# EAGLE schematic waterlevel (EAGLE 6.2)
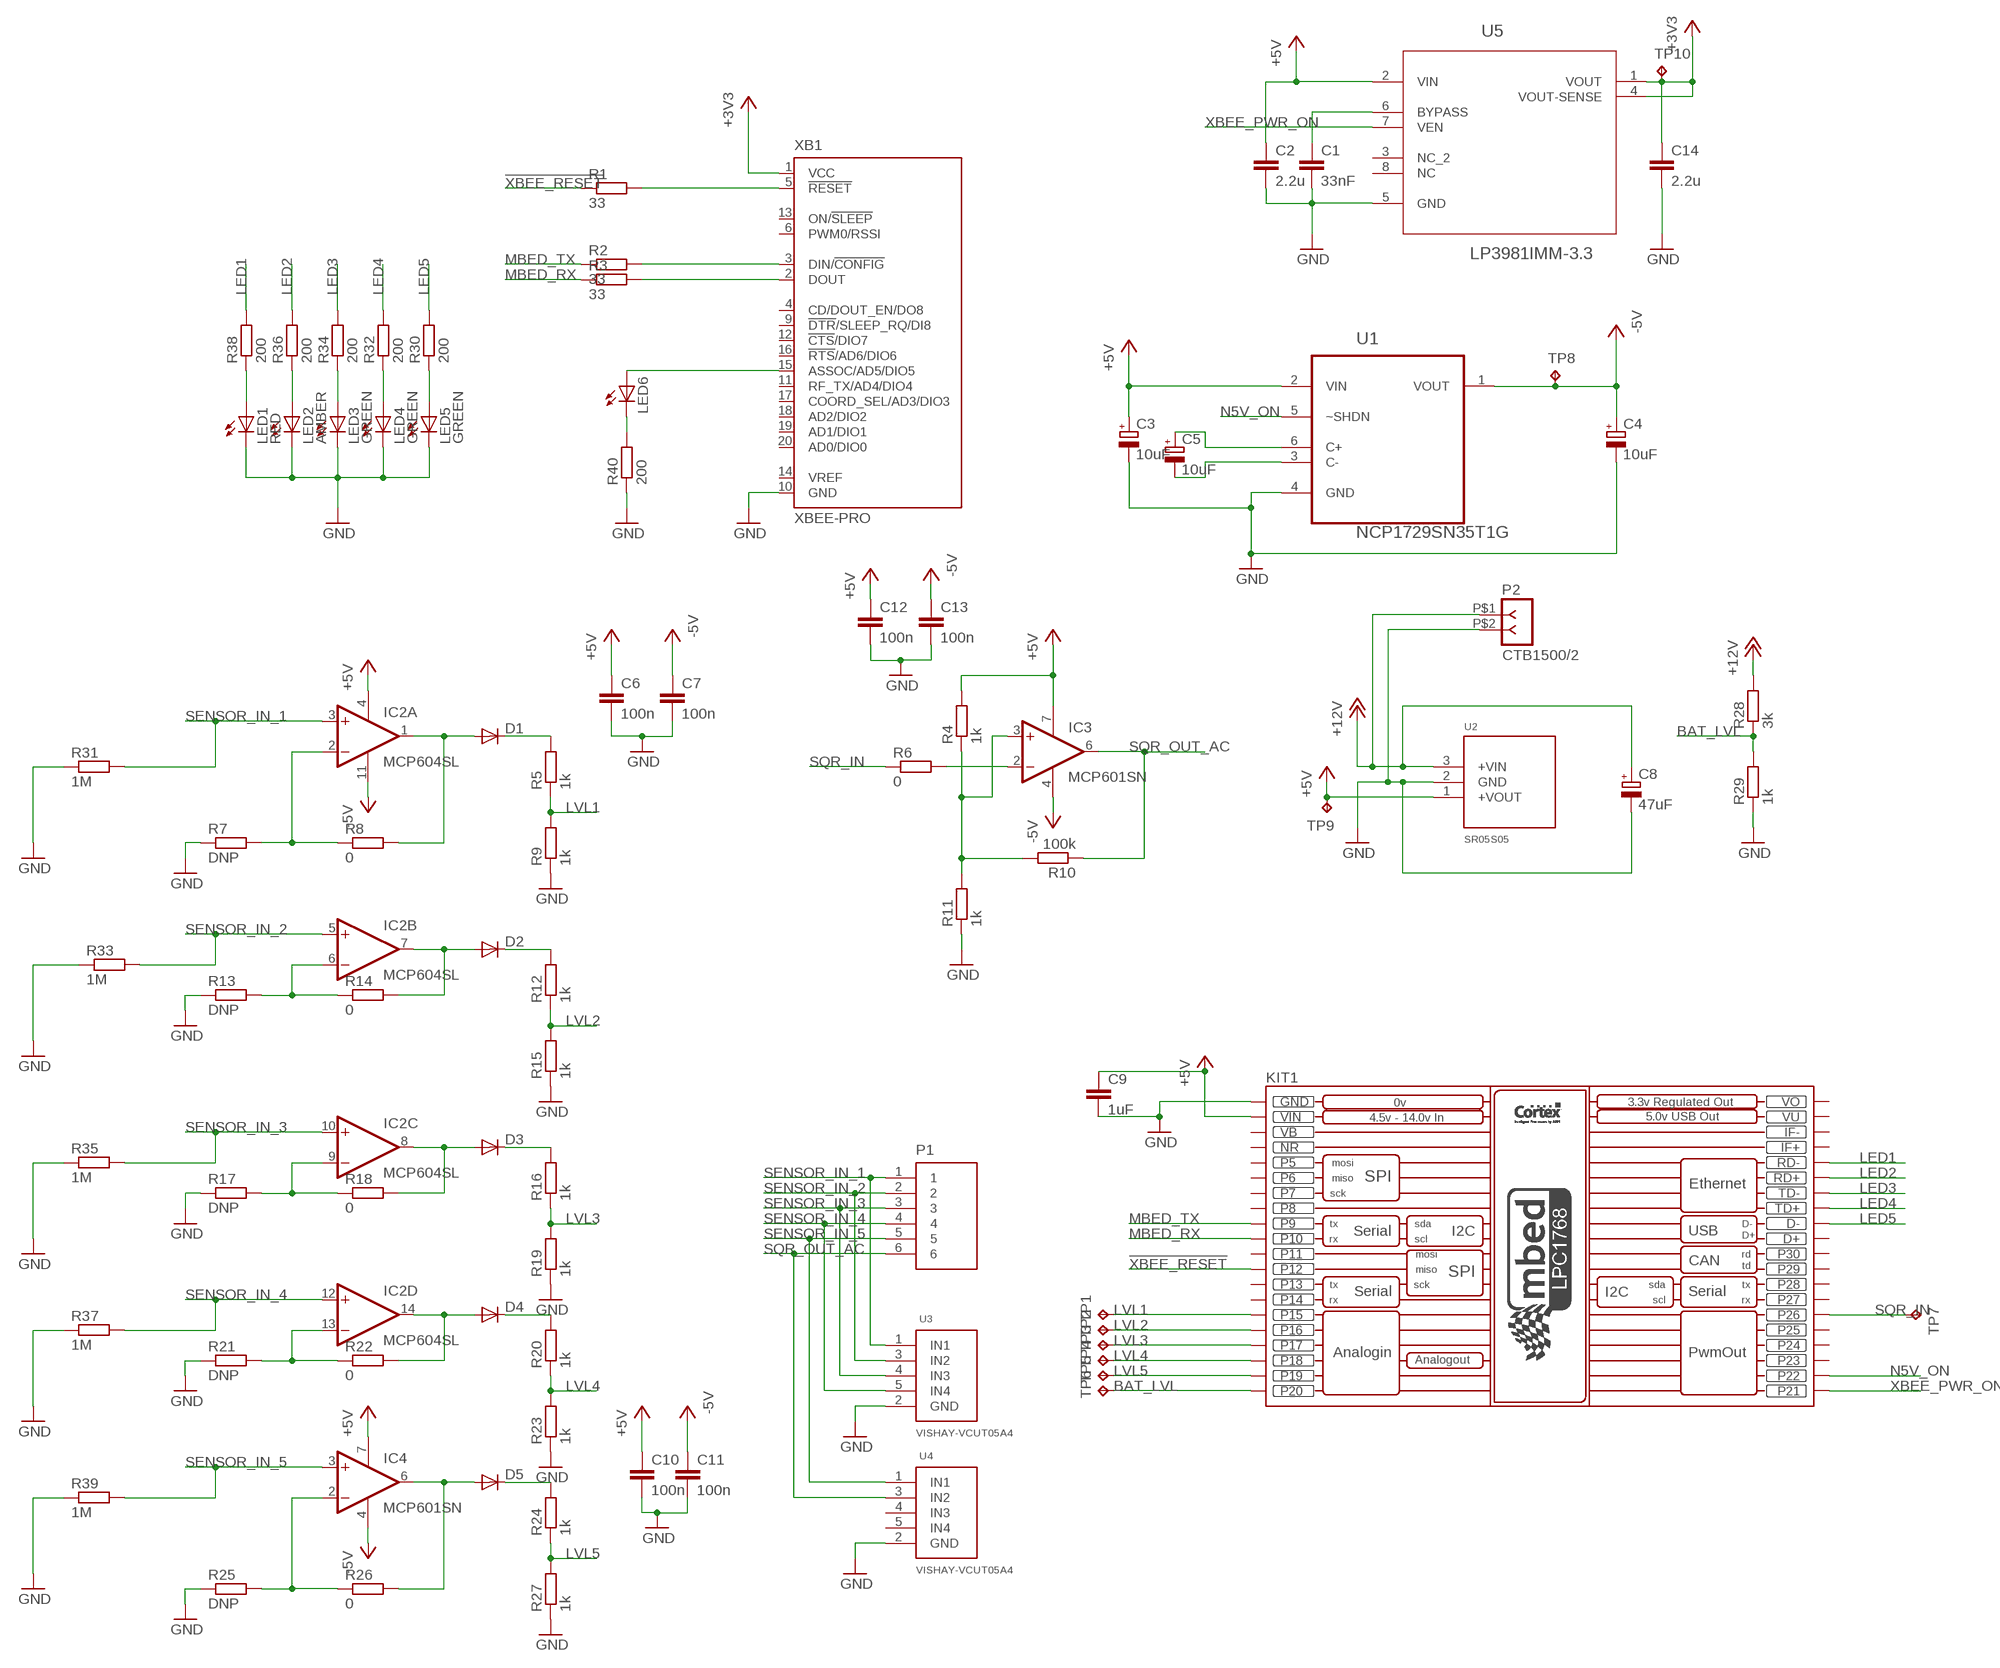
[diagram p0: schematic, sheet 1]

## Parts
C1  33nF  C-EUC0603  [C0603]
C2  2.2u  C-EUC0603  [C0603]
C3  10uF  CPOL-EUD/7343-31R  [D/7343-31R]
C4  10uF  CPOL-EUD/7343-31R  [D/7343-31R]
C5  10uF  CPOL-EUD/7343-31R  [D/7343-31R]
C6  100n  C-EUC1206  [C1206]
C7  100n  C-EUC1206  [C1206]
C8  47uF  CPOL-EUD/7343-31R  [D/7343-31R]
C9  1uF  C-EUC1206  [C1206]
C10  100n  C-EUC1206  [C1206]
C11  100n  C-EUC1206  [C1206]
C12  100n  C-EUC1206  [C1206]
C13  100n  C-EUC1206  [C1206]
C14  2.2u  C-EUC0603  [C0603]
D1  DIODE-SOD323-R  [SOD323-R]
D2  DIODE-SOD323-R  [SOD323-R]
D3  DIODE-SOD323-R  [SOD323-R]
D4  DIODE-SOD323-R  [SOD323-R]
D5  DIODE-SOD323-R  [SOD323-R]
IC2  MCP604SL  [SO14]
IC3  MCP601SN  [SO08]
IC4  MCP601SN  [SO08]
KIT1  MBED_NXP_LPC1768  [MBED-KIT]
LED1  RED  LEDCHIPLED_0805  [CHIPLED_0805]
LED2  AMBER  LEDCHIPLED_0805  [CHIPLED_0805]
LED3  GREEN  LEDCHIPLED_0805  [CHIPLED_0805]
LED4  GREEN  LEDCHIPLED_0805  [CHIPLED_0805]
LED5  GREEN  LEDCHIPLED_0805  [CHIPLED_0805]
LED6  LEDCHIPLED_0805  [CHIPLED_0805]
P1  CAMDEN-CTB5000/6  [CAMDEN-CTB5000]
P2  CTB1500/2  [CTB1500-2]
R1  33  R-EU_R0603  [R0603]
R2  33  R-EU_R0603  [R0603]
R3  33  R-EU_R0603  [R0603]
R4  1k  R-EU_R0805  [R0805]
R5  1k  R-EU_R0805  [R0805]
R6  0  R-EU_R0603  [R0603]
R7  DNP  R-EU_R0603  [R0603]
R8  0  R-EU_R0603  [R0603]
R9  1k  R-EU_R0805  [R0805]
R10  100k  R-EU_R0805  [R0805]
R11  1k  R-EU_R0805  [R0805]
R12  1k  R-EU_R0805  [R0805]
R13  DNP  R-EU_R0603  [R0603]
R14  0  R-EU_R0603  [R0603]
R15  1k  R-EU_R0805  [R0805]
R16  1k  R-EU_R0805  [R0805]
R17  DNP  R-EU_R0603  [R0603]
R18  0  R-EU_R0603  [R0603]
R19  1k  R-EU_R0805  [R0805]
R20  1k  R-EU_R0805  [R0805]
R21  DNP  R-EU_R0603  [R0603]
R22  0  R-EU_R0603  [R0603]
R23  1k  R-EU_R0805  [R0805]
R24  1k  R-EU_R0805  [R0805]
R25  DNP  R-EU_R0603  [R0603]
R26  0  R-EU_R0603  [R0603]
R27  1k  R-EU_R0805  [R0805]
R28  3k  R-EU_R0805  [R0805]
R29  1k  R-EU_R0805  [R0805]
R30  200  R-EU_R0603  [R0603]
R31  1M  R-EU_R0805  [R0805]
R32  200  R-EU_R0603  [R0603]
R33  1M  R-EU_R0805  [R0805]
R34  200  R-EU_R0603  [R0603]
R35  1M  R-EU_R0805  [R0805]
R36  200  R-EU_R0603  [R0603]
R37  1M  R-EU_R0805  [R0805]
R38  200  R-EU_R0603  [R0603]
R39  1M  R-EU_R0805  [R0805]
R40  200  R-EU_R0603  [R0603]
TP1  TPTP13R  [TP13R]
TP2  TPTP13R  [TP13R]
TP3  TPTP13R  [TP13R]
TP4  TPTP13R  [TP13R]
TP5  TPTP13R  [TP13R]
TP6  TPTP13R  [TP13R]
TP7  TPTP13R  [TP13R]
TP8  TPTP13R  [TP13R]
TP9  TPTP13R  [TP13R]
TP10  TPTP13R  [TP13R]
U1  NCP1729SN35T1G  [SOP95P275X110-6N]
U2  SR05S05  [XP-SR-SERIES]
U3  VISHAY-VCUT05A4  [SOT23-5]
U4  VISHAY-VCUT05A4  [SOT23-5]
U5  LP3981IMM-3.3  [SOP65P490X110-8N]
XB1  XBEE-PRO  [XBEE-PRO]

## Nets
!XBEE_RESET!: KIT1.P$12(P12) R1.1
+3V3: C14.1 TP10.TP U5.1(VOUT) U5.4(VOUT-SENSE) XB1.1(VCC)
+5V: C2.1 C3.+ C6.1 C9.1 C10.1 C12.1 IC2.4(P:V+) IC3.7(V+) IC4.7(V+) KIT1.VIN R4.2 TP9.TP U1.2(VIN) U2.1(+VOUT) U5.2(VIN)
+12V: C8.+ P2.P$1 R28.2 U2.3(+VIN)
-5V: C4.+ C7.1 C11.1 C13.1 IC2.11(P:V-) IC3.4(V-) IC4.4(V-) TP8.TP U1.1(VOUT)
BAT_LVL: KIT1.P$20(P20) R28.1 R29.2 TP6.TP
GND: C1.2 C2.2 C3.- C4.- C6.2 C7.2 C8.- C9.2 C10.2 C11.2 C12.2 C13.2 C14.2 KIT1.GND LED1.C LED2.C LED3.C LED4.C LED5.C P2.P$2 R7.1 R9.1 R11.1 R13.1 R15.1 R17.1 R19.1 R21.1 R23.1 R25.1 R27.1 R29.1 R31.1 R33.1 R35.1 R37.1 R39.1 R40.1 U1.4(GND) U2.2(GND) U3.2(GND) U4.2(GND) U5.5(GND) XB1.10(GND)
LED1: KIT1.RD- R38.2
LED2: KIT1.RD+ R36.2
LED3: KIT1.TD- R34.2
LED4: KIT1.TD+ R32.2
LED5: KIT1.D- R30.2
LVL1: KIT1.P$15(P15) R5.1 R9.2 TP1.TP
LVL2: KIT1.P$16(P16) R12.1 R15.2 TP2.TP
LVL3: KIT1.P$17(P17) R16.1 R19.2 TP3.TP
LVL4: KIT1.P$18(P18) R20.1 R23.2 TP4.TP
LVL5: KIT1.P$19(P19) R24.1 R27.2 TP5.TP
MBED_RX: KIT1.P$10(P10) R3.1
MBED_TX: KIT1.P$9(P9) R2.1
N5V_ON: KIT1.P$22(P22) U1.5(~SHDN)
N$1: IC3.2(-IN) R6.2
N$2: D2.A IC2.7(B:OUT) R14.2
N$3: D3.A IC2.8(C:OUT) R18.2
N$4: D4.A IC2.14(D:OUT) R22.2
N$5: D5.A IC4.6(OUT) R26.2
N$6: IC4.2(-IN) R25.2 R26.1
N$7: IC2.13(D:-IN) R21.2 R22.1
N$8: IC2.9(C:-IN) R17.2 R18.1
N$9: IC2.6(B:-IN) R13.2 R14.1
N$10: IC2.2(A:-IN) R7.2 R8.1
N$11: C5.+ U1.6(C+)
N$12: D2.C R12.2
N$13: C5.- U1.3(C-)
N$14: D1.C R5.2
N$15: D1.A IC2.1(A:OUT) R8.2
N$16: D3.C R16.2
N$17: LED6.A XB1.15(ASSOC/AD5/DIO5)
N$18: D4.C R20.2
N$19: R1.2 XB1.5(!RESET)
N$20: D5.C R24.2
N$21: R2.2 XB1.3(DIN/!CONFIG)
N$22: R3.2 XB1.2(DOUT)
N$23: IC3.3(+IN) R4.1 R10.2 R11.2
N$24: LED6.C R40.2
N$25: LED5.A R30.1
N$26: LED4.A R32.1
N$27: LED3.A R34.1
N$28: C1.1 U5.6(BYPASS)
N$29: LED2.A R36.1
N$30: LED1.A R38.1
SENSOR_IN_1: IC2.3(A:+IN) P1.1 R31.2 U3.1(IN1)
SENSOR_IN_2: IC2.5(B:+IN) P1.2 R33.2 U3.3(IN2)
SENSOR_IN_3: IC2.10(C:+IN) P1.3 R35.2 U3.4(IN3)
SENSOR_IN_4: IC2.12(D:+IN) P1.4 R37.2 U3.5(IN4)
SENSOR_IN_5: IC4.3(+IN) P1.5 R39.2 U4.1(IN1)
SQR_IN: KIT1.P$26(P26) R6.1 TP7.TP
SQR_OUT_AC: IC3.6(OUT) P1.6 R10.1 U4.3(IN2)
XBEE_PWR_ON: KIT1.P$21(P21) U5.7(VEN)
Unconnected: KIT1.D+ KIT1.IF+ KIT1.IF- KIT1.P$5(P5) KIT1.P$6(P6) KIT1.P$7(P7) KIT1.P$8(P8) KIT1.P$11(P11) KIT1.P$13(P13) KIT1.P$14(P14) KIT1.P$23(P23) KIT1.P$24(P24) KIT1.P$25(P25) KIT1.P$27(P27) KIT1.P$28(P28) KIT1.P$29(P29) KIT1.P$30(P30) U4.4(IN3) U4.5(IN4) U5.3(NC_2) U5.8(NC) XB1.4(CD/DOUT_EN/DO8) XB1.6(PWM0/RSSI) XB1.9(!DTR!/SLEEP_RQ/DI8) XB1.11(RF_TX/AD4/DIO4) XB1.12(!CTS!/DIO7) XB1.13(ON/!SLEEP) XB1.14(VREF) XB1.16(!RTS!/AD6/DIO6) XB1.17(COORD_SEL/AD3/DIO3) XB1.18(AD2/DIO2) XB1.19(AD1/DIO1) XB1.20(AD0/DIO0)

## Power pins joined to a net without a drawn wire
NR: KIT1.NR
VB: KIT1.VB
VO: KIT1.VOUT(VO)
VU: KIT1.VU

## Library data of the parts
C1 C6 C7 C9-C13 = resistor:C-EU: CAPACITOR, European symbol
C2 C14 = resistor:C-EU: CAPACITOR, European symbol; FARNELL: 1759400
C3-C5 C8 = resistor:CPOL-EU: POLARIZED CAPACITOR, European symbol; FARNELL: 2112950
D1-D5 = diode:DIODE-: DIODE; FARNELL: 1907691; PART: RB751V40
IC2 = linear:MCP604: Quad Op Amp 2.7V to 6.0V Single Supply CMOS Source: http://ww1.microchip.com/downloads/en/DeviceDoc/21314g.pdf
IC3 IC4 = linear:MCP601: Single Op Amp 2.7V to 6.0V Single Supply CMOS Source: http://ww1.microchip.com/downloads/en/DeviceDoc/21314g.pdf
KIT1 = MBED_v2.1:MBED_NXP_LPC1768: Mbed LPC1768 - ARM CORTEX v2.1 * Schematic symbol is now placed in eagles's default raster. *The pads diameter are suitable for routing between mbed pins * mbed pads are 0.8 mm drill diameter. --------------------------------------------- Created by: Mohamed Yousry *Alexandria, Egypt *Email: mohamed.yousry@ieeegoldegypt.org
LED1-LED6 = led:LED: LED OSRAM: - CHIPLED LG R971, LG N971, LY N971, LG Q971, LY Q971, LO R971, LY R971 LH N974, LH R974 LS Q976, LO Q976, LY Q976 LO Q996 - Hyper CHIPLED LW Q18S LB Q993, LB Q99A, LB R99A - SideLED LS A670, LO A670, LY A670, LG A670, LP A670 LB A673, LV A673, LT A673, LW A673 LH A674 LY A675 LS A676, LA A676, LO A676, LY A676, LW A676 LS A679, LY A679, LG A679 - Hyper Micro SIDELED® LS Y876, LA Y876, LO Y876, LY Y876 LT Y87S - SmartLED LW L88C, LW L88S LB L89C, LB L89S, LG L890 LS L89K, LO L89K, LY L89K LS L896, LA L896, LO L896, LY L896 - TOPLED LS T670, LO T670, LY T670, LG T670, LP T670 LSG T670, LSP T670, LSY T670, LOP T670, LYG T670 LG T671, LOG T671, LSG T671 LB T673, LV T673, LT T673, LW T673 LH T674 LS T676, LA T676, LO T676, LY T676, LB T676, LH T676, LSB T676, LW T676 LB T67C, LV T67C, LT T67C, LS T67K, LO T67K, LY T67K, LW E67C LS E67B, LA E67B, LO E67B, LY E67B, LB E67C, LV E67C, LT E67C LW T67C LS T679, LY T679, LG T679 LS T770, LO T770, LY T770, LG T770, LP T770 LB T773, LV T773, LT T773, LW T773 LH T774 LS E675, LA E675, LY E675, LS T675 LS T776, LA T776, LO T776, LY T776, LB T776 LHGB T686 LT T68C, LB T68C - Hyper Mini TOPLED® LB M676 - Mini TOPLED Santana® LG M470 LS M47K, LO M47K, LY M47K Source: http://www.osram.convergy.de LUXEON: - LUMILED® LXK2-PW12-R00, LXK2-PW12-S00, LXK2-PW14-U00, LXK2-PW14-V00 LXK2-PM12-R00, LXK2-PM12-S00, LXK2-PM14-U00 LXK2-PE12-Q00, LXK2-PE12-R00, LXK2-PE12-S00, LXK2-PE14-T00, LXK2-PE14-U00 LXK2-PB12-K00, LXK2-PB12-L00, LXK2-PB12-M00, LXK2-PB14-N00, LXK2-PB14-P00, LXK2-PB14-Q00 LXK2-PR12-L00, LXK2-PR12-M00, LXK2-PR14-Q00, LXK2-PR14-R00 LXK2-PD12-Q00, LXK2-PD12-R00, LXK2-PD12-S00 LXK2-PH12-R00, LXK2-PH12-S00 LXK2-PL12-P00, LXK2-PL12-Q00, LXK2-PL12-R00 Source: www.luxeon.com KINGBRIGHT: KA-3528ASYC Source: www.kingbright.com
P1 = connectors-terminal:CAMDEN-CTB5000/6; FARNELL: CN11531
P2 = eko-parts:CTB1500/2
R1-R40 = resistor:R-EU_: RESISTOR, European symbol
TP1-TP10 = testpad:TP: Test pad
U1 = eko-parts:NCP1729SN35T1G: Switched Capacitor Voltage Inverter; MPN: NCP1729SN35T1G; OC_FARNELL: 1652414; OC_NEWARK: 45J1868; PACKAGE: TSOP-6; SUPPLIER: ON SEMICONDUCTOR
U2 = eko-parts:SR05S05; FARNELL: 1861084
U3 U4 = diodes:VISHAY-VCUT05A4
U5 = eko-parts:LP3981IMM-3.3: Ultra Low-Dropout CMOS Voltage Regulator; MPN: LP3981IMM-3.3; OC_FARNELL: 1685563; OC_NEWARK: 41K7899; PACKAGE: MSOP-8; SUPPLIER: NationalSemiconductor
XB1 = maxstream:XBEE: XBee (TM) /XBee-PRO(TM) OEM RF Modules Source: MaxStream, Inc. xbee_productmanual.pdf; MPN: XBP24-AWI-001; OC_FARNELL: 1337916; OC_NEWARK: 42M2667